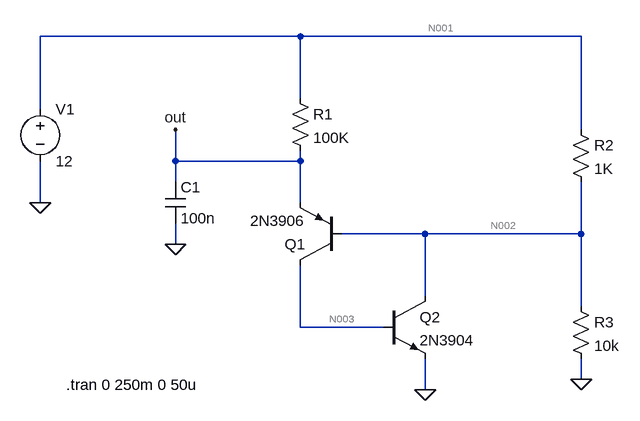
[diagram p0: schematic AC 05.asc]
AC 05.asc, the LTspice schematic file:
Version 4
SHEET 1 880 680
WIRE 336 -240 -64 -240
WIRE 768 -240 336 -240
WIRE 336 -144 336 -240
WIRE -64 -128 -64 -240
WIRE 768 -96 768 -240
WIRE 144 -48 144 -96
WIRE 336 -48 336 -64
WIRE 336 -48 144 -48
WIRE 144 -16 144 -48
WIRE -64 16 -64 -48
WIRE 336 16 336 -48
WIRE 528 64 400 64
WIRE 768 64 768 -16
WIRE 768 64 528 64
WIRE 144 80 144 48
WIRE 528 160 528 64
WIRE 768 176 768 64
WIRE 336 208 336 112
WIRE 464 208 336 208
WIRE 768 288 768 256
WIRE 528 304 528 256
FLAG 144 80 0
FLAG 528 304 0
FLAG 768 288 0
FLAG -64 16 0
FLAG 144 -96 out
SYMBOL res 320 -160 R0
SYMATTR InstName R1
SYMATTR Value 100K
SYMBOL res 752 -112 R0
SYMATTR InstName R2
SYMATTR Value 1K
SYMBOL res 752 160 R0
SYMATTR InstName R3
SYMATTR Value 10k
SYMBOL pnp 400 112 R180
SYMATTR InstName Q1
SYMATTR Value 2N3906
SYMBOL cap 128 -16 R0
SYMATTR InstName C1
SYMATTR Value 100n
SYMBOL voltage -64 -144 R0
SYMATTR InstName V1
SYMATTR Value 12
SYMBOL npn 464 160 R0
SYMATTR InstName Q2
SYMATTR Value 2N3904
TEXT -24 296 Left 2 !.tran 0 250m 0 50u

The netlist it stands for:
* AC 05.asc
R1 N001 out 100K
R2 N001 N002 1K
R3 N002 0 10k
Q1 N003 N002 out 0 2N3906
C1 out 0 100n
V1 N001 0 12
Q2 N002 N003 0 0 2N3904
.model NPN NPN
.model PNP PNP
.lib standard.bjt
.tran 0 250m 0 50u
.backanno
.end

* Results of the author's LTspice run, read from the files saved beside the schematic
* Operating Point, zero values left out:
*   V(n001) = 12 V
*   V(out) = 738.6 mV
*   V(n002) = 118.6 mV
*   V(n003) = 723.2 mV
*   Ic(Q1) = -76.79 µA
*   Ib(Q1) = -35.82 µA
*   Ie(Q1) = 112.6 µA
*   Ic(Q2) = 11.91 mA
*   Ib(Q2) = 76.79 µA
*   Ie(Q2) = -11.98 mA
*   I(R1) = 112.6 µA
*   I(R2) = 11.88 mA
*   I(R3) = 11.86 µA
*   I(V1) = -11.99 mA
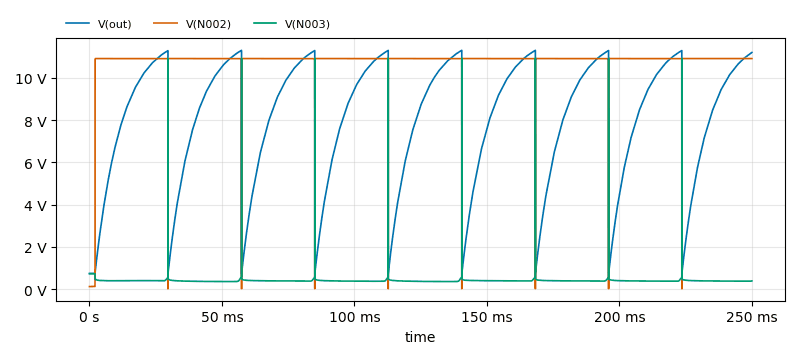
[diagram p1: Transient Analysis of AC 05.asc, plotted from the saved traces]
* Transient Analysis, 1 run:
*   V(out): min 732.3 mV, max 11.3 V, average 8.085 V, rms 8.616 V, last 11.2 V
*   V(N002): min 11.77 mV, max 10.91 V, average 10.81 V, rms 10.86 V, last 10.91 V
*   V(N003): min 353 mV, max 10.93 V, average 391.9 mV, rms 396.9 mV, last 384 mV